# Altium project 2019主控板v1.1.PrjPcb
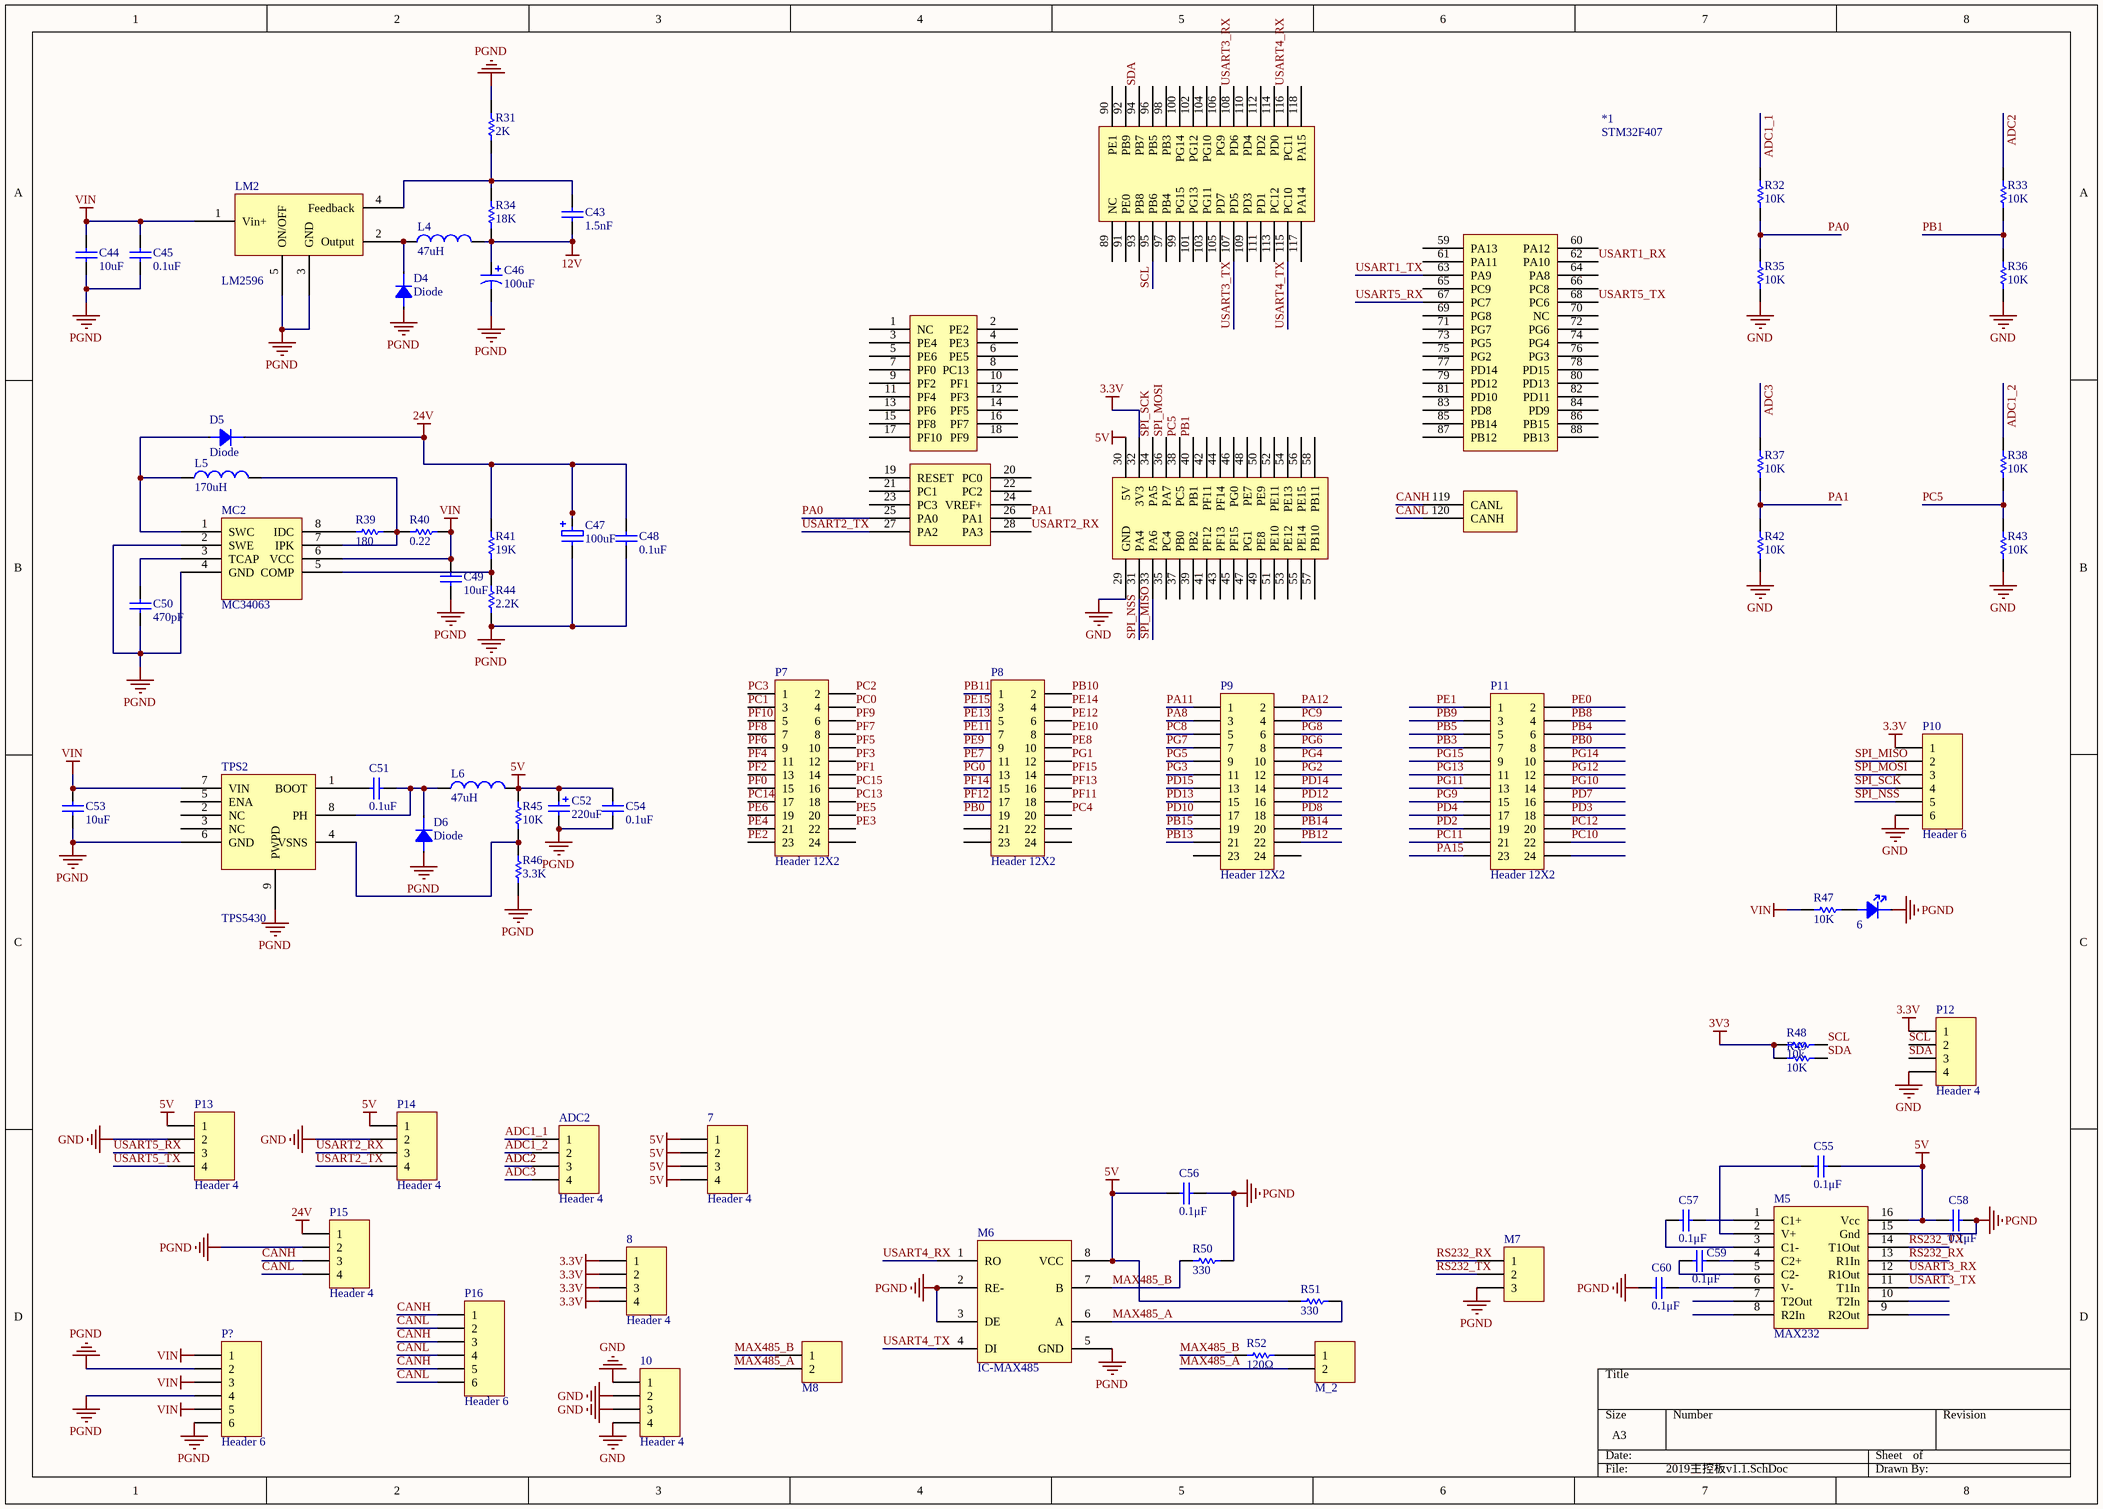
[diagram p0: 2019主控板v1.1.SchDoc]
1 sheet, 71 parts. Net scope: global (net labels, ports and power ports of the same name join across sheets).
Board file: 2019主控板v1.1.PcbDoc

## Sheet 2019主控板v1.1.SchDoc
size A3

### Parts
6  lED  [0805D]  (value not drawn)
7  Header 4  [HDR1X4]
8  Header 4  [HDR1X4]
10  Header 4  [HDR1X4]
*1  STM32F407  [STM32F407]
ADC2  Header 4  [HDR1X4]
C43  value 1.5nF  [CAP-MLCC-0603]  (hidden comment: Cap)
C44  value 10uF  [0805C]  (hidden comment: Cap)
C45  value 0.1uF  [CAP-MLCC-0603]  (hidden comment: Cap)
C46  value 100uF  [6032C]  (hidden comment: Cap Pol3)
C47  100uF  [C_ELE]
C48  value 0.1uF  [CAP-MLCC-0603]  (hidden comment: Cap)
C49  value 10uF  [0805C]  (hidden comment: Cap)
C50  value 470pF  [CAP-MLCC-0603]  (hidden comment: Cap)
C51  value 0.1uF  [CAP-MLCC-0603]  (hidden comment: Cap)
C52  value 220uF  [CAP-TAN-7343/CAPD]  (hidden comment: Cap Pol1)
C53  value 10uF  [0805C]  (hidden comment: Cap)
C54  value 0.1uF  [CAP-MLCC-0603]  (hidden comment: Cap)
C55  0.1μF  [CAP-MLCC-0603]
C56  0.1μF  [CAP-MLCC-0603]
C57  0.1μF  [CAP-MLCC-0603]
C58  0.1μF  [CAP-MLCC-0603]
C59  0.1μF  [CAP-MLCC-0603]
C60  0.1μF  [CAP-MLCC-0603]
D4  Diode  [SS34]
D5  Diode  [SS34]
D6  Diode  [SS34]
L4  value 47uH  [CD52]  (hidden comment: Inductor)
L5  value 170uH  [CD74]  (hidden comment: Inductor)
L6  value 47uH  [CD52]  (hidden comment: Inductor)
LM2  LM2596  [TO-263-5]
M5  MAX232  [SO-16_M]
M6  IC-MAX485  [SO8_M]
M7  Header 3  [Green_3P]  (value not drawn)
M8  Header 2  [Green_2P]  (value not drawn)
M_2  Header 2  [SIP2]  (value not drawn)
MC2  MC34063  [SO8]
P7  Header 12X2  [HDR2X12]
P8  Header 12X2  [HDR2X12]
P9  Header 12X2  [HDR2X12]
P10  Header 6  [HDR1X6]
P11  Header 12X2  [HDR2X12]
P12  Header 4  [HDR1X4]
P13  Header 4  [HDR1X4]
P14  Header 4  [HDR1X4]
P15  Header 4  [XH-2.54pin4]
P16  Header 6  [Green_6P]
P?  Header 6  [Green_6P]
R31  value 2K  [RES-0603]  (hidden comment: Res1)
R32  value 10K  [RES-0603]  (hidden comment: Res1)
R33  value 10K  [RES-0603]  (hidden comment: Res1)
R34  value 18K  [RES-0603]  (hidden comment: Res1)
R35  value 10K  [RES-0603]  (hidden comment: Res1)
R36  value 10K  [RES-0603]  (hidden comment: Res1)
R37  value 10K  [RES-0603]  (hidden comment: Res1)
R38  value 10K  [RES-0603]  (hidden comment: Res1)
R39  value 180  [RES-0603]  (hidden comment: Res1)
R40  value 0.22  [RES-0603]  (hidden comment: Res1)
R41  value 19K  [RES-0603]  (hidden comment: Res1)
R42  value 10K  [RES-0603]  (hidden comment: Res1)
R43  value 10K  [RES-0603]  (hidden comment: Res1)
R44  value 2.2K  [RES-0603]  (hidden comment: Res1)
R45  value 10K  [RES-0603]  (hidden comment: Res1)
R46  value 3.3K  [RES-0603]  (hidden comment: Res1)
R47  value 10K  [RES-0603]  (hidden comment: Res1)
R48  10k  [RES-0603]
R49  10K  [RES-0603]
R50  330  [RES-0603]
R51  330  [RES-0603]
R52  120Ω  [RES-0603]
TPS2  TPS5430  [TPS5430]

### Nets
3.3V: 8.1 8.2 8.3 8.4 *1.32(3V3) P10.1 P12.1
3V3: R48.1 R49.1
5V: 7.1 7.2 7.3 7.4 *1.30(5V) C52.1 C54.2 C55.2 C56.1 C58.1 L6.2 M5.16(Vcc) M6.8(VCC) P13.1 P14.1 R45.2 R51.2
12V: C43.1 C46.1 L4.2 R34.1
24V: C47.1 C48.2 D5.K P15.1 R41.1
GND: 10.1 10.2 10.3 10.4 *1.29(GND) P10.6 P12.4 P13.2 P14.2 R35.1 R36.1 R42.1 R43.1
PGND: 6.K C44.1 C45.1 C46.2 C47.2 C48.1 C49.1 C50.1 C52.2 C53.1 C54.1 C56.2 C58.2 C60.1 D4.A D6.A LM2.3(GND) LM2.5(ON/OFF) M5.15(Gnd) M6.2(RE-) M6.3(DE) M6.5(GND) M7.3 MC2.2(SWE) MC2.4(GND) P15.2 P?.2 P?.4 P?.6 R31.1 R44.2 R46.1 R50.1 TPS2.6(GND) TPS2.9(PWPD)
VIN: C44.2 C45.2 C49.2 C53.2 LM2.1(Vin+) MC2.6(VCC) P?.1 P?.3 P?.5 R40.1 R47.2 TPS2.7(VIN)
ADC1_1: ADC2.1 R32.2
ADC1_2: ADC2.2 R38.2
ADC2: ADC2.3 R33.2
ADC3: ADC2.4 R37.2
CANH: *1.119(CANL) P15.3 P16.1 P16.3 P16.5
CANL: *1.120(CANH) P15.4 P16.2 P16.4 P16.6
MAX485_A: M6.6(A) M8.2 M_2.2 R51.1
MAX485_B: M6.7(B) M8.1 R50.2 R52.2
PA0: *1.25(PA0) R32.1 R35.2
PA1: *1.26(PA1) R37.1 R42.2
PA8: P9.3
PA11: P9.1
PA12: P9.2
PA15: P11.23
PB0: P8.19 P11.8
PB1: *1.40(PB1) R33.1 R36.2
PB3: P11.7
PB4: P11.6
PB5: P11.5
PB8: P11.4
PB9: P11.3
PB10: P8.2
PB11: P8.1
PB12: P9.22
PB13: P9.21
PB14: P9.20
PB15: P9.19
PC0: P7.4
PC1: P7.3
PC2: P7.2
PC3: P7.1
PC4: P8.20
PC5: *1.38(PC5) R38.1 R43.2
PC8: P9.5
PC9: P9.4
PC10: P11.22
PC11: P11.21
PC12: P11.20
PC13: P7.18
PC14: P7.17
PC15: P7.16
PD2: P11.19
PD3: P11.18
PD4: P11.17
PD7: P11.16
PD8: P9.18
PD10: P9.17
PD12: P9.16
PD13: P9.15
PD14: P9.14
PD15: P9.13
PE0: P11.2
PE1: P11.1
PE2: P7.23
PE3: P7.22
PE4: P7.21
PE5: P7.20
PE6: P7.19
PE7: P8.11
PE8: P8.10
PE9: P8.9
PE10: P8.8
PE11: P8.7
PE12: P8.6
PE13: P8.5
PE14: P8.4
PE15: P8.3
PF0: P7.15
PF1: P7.14
PF2: P7.13
PF3: P7.12
PF4: P7.11
PF5: P7.10
PF6: P7.9
PF7: P7.8
PF8: P7.7
PF9: P7.6
PF10: P7.5
PF11: P8.18
PF12: P8.17
PF13: P8.16
PF14: P8.15
PF15: P8.14
PG0: P8.13
PG1: P8.12
PG2: P9.12
PG3: P9.11
PG4: P9.10
PG5: P9.9
PG6: P9.8
PG7: P9.7
PG8: P9.6
PG9: P11.15
PG10: P11.14
PG11: P11.13
PG12: P11.12
PG13: P11.11
PG14: P11.10
PG15: P11.9
RS232_RX: M5.13(R1In) M7.1
RS232_TX: M5.14(T1Out) M7.2
SCL: *1.95(PB6) P12.2 R48.2
SDA: *1.94(PB7) P12.3 R49.2
SPI_MISO: *1.33(PA6) P10.2
SPI_MOSI: *1.36(PA7) P10.3
SPI_NSS: *1.31(PA4) P10.5
SPI_SCK: *1.34(PA5) P10.4
USART1_RX: *1.62(PA10)
USART1_TX: *1.63(PA9)
USART2_RX: *1.28(PA3) P14.3
USART2_TX: *1.27(PA2) P14.4
USART3_RX: *1.108(PD6) M5.12(R1Out)
USART3_TX: *1.107(PD5) M5.11(T1In)
USART4_RX: *1.116(PC11) M6.1(RO)
USART4_TX: *1.115(PC10) M6.4(DI)
USART5_RX: *1.67(PC7) P13.3
USART5_TX: *1.68(PC6) P13.4
Net6_A: 6.A R47.1
NetC43_2: C43.2 LM2.4(Feedback) R31.2 R34.2
NetC50_2: C50.2 MC2.3(TCAP)
NetC51_1: C51.1 TPS2.1(BOOT)
NetC51_2: C51.2 D6.K L6.1 TPS2.8(PH)
NetC55_1: C55.1 M5.2(V+)
NetC57_1: C57.1 M5.3(C1-)
NetC57_2: C57.2 M5.1(C1+)
NetC59_1: C59.1 M5.5(C2-)
NetC59_2: C59.2 M5.4(C2+)
NetC60_2: C60.2 M5.6(V-)
NetD4_K: D4.K L4.1 LM2.2(Output)
NetD5_A: D5.A L5.1 MC2.1(SWC)
NetL5_2: L5.2 MC2.7(IPK) R39.1 R40.2
NetM_2_1: M_2.1 R52.1
NetMC2_5: MC2.5(COMP) R41.2 R44.1
NetMC2_8: MC2.8(IDC) R39.2
NetR45_1: R45.1 R46.2 TPS2.4(VSNS)

Not connected (* = marked no-connect by the designer): *1 1(NC) 2(PE2) 3(PE4) 4(PE3) 5(PE6) 6(PE5) 7(PF0) 8(PC13) 9(PF2) 10(PF1) 11(PF4) 12(PF3) 13(PF6) 14(PF5) 15(PF8) 16(PF7) 17(PF10) 18(PF9) 19(RESET) 20(PC0) 21(PC1) 22(PC2) 23(PC3) 24(VREF+) 35(PC4) 37(PB0) 39(PB2) 41(PF12) 42(PF11) 43(PF13) 44(PF14) 45(PF15) 46(PG0) 47(PG1) 48(PE7) 49(PE8) 50(PE9) 51(PE10) 52(PE11) 53(PE12) 54(PE13) 55(PE14) 56(PE15) 57(PB10) 58(PB11) 59(PA13) 60(PA12) 61(PA11) 64(PA8) 65(PC9) 66(PC8) 69(PG8) 70(NC) 71(PG7) 72(PG6) 73(PG5) 74(PG4) 75(PG2) 76(PG3) 77(PD14) 78(PD15) 79(PD12) 80(PD13) 81(PD10) 82(PD11) 83(PD8) 84(PD9) 85(PB14) 86(PB15) 87(PB12) 88(PB13) 89(NC) 90(PE1) 91(PE0) 92(PB9) 93(PB8) 96(PB5) 97(PB4) 98(PB3) 99(PG15) 100(PG14) 101(PG13) 102(PG12) 103(PG11) 104(PG10) 105(PD7) 106(PG9) 109(PD3) 110(PD4) 111(PD1) 112(PD2) 113(PC12) 114(PD0) 117(PA14) 118(PA15); M5 7(T2Out) 8(R2In) 9(R2Out) 10(T2In); P7 24; P8 21 22 23 24; P9 23 24; P11 24; TPS2 2(NC) 3(NC) 5(ENA)

### Library data of the parts
6 = 00-D-LED
7 8 10 ADC2 P12-P15 = Header 4: Header, 4-Pin; LatestRevisionDate: 17-Jul-2002; LatestRevisionNote: Re-released for DXP Platform.; Publisher: Altium Limited
C43-C45 C48-C51 C53 C54 = Cap: Capacitor; Published: 8-Jun-2000; LatestRevisionDate: 17-Jul-2002; LatestRevisionNote: Re-released for DXP Platform.; PackageReference: RAD-0.3; Publisher: Altium Limited
C46 = Cap Pol3: Polarized Capacitor (Surface Mount); Published: 8-Jun-2000; LatestRevisionDate: 17-Jul-2002; LatestRevisionNote: Re-released for DXP Platform.; PackageReference: C0805; Publisher: Altium Limited
C47 = CAP-ELE: 电解电容; Value: *μF; Published: 8-Jun-2000; LatestRevisionDate: 17-Jul-2002; LatestRevisionNote: Re-released for DXP Platform.; PackageReference: RB7.6-15; Publisher: Altium Limited; PackageDescription: Polarized Capacitor (Radial); 2 Leads
C52 = Cap Pol1: Polarized Capacitor (Radial); Published: 8-Jun-2000; LatestRevisionDate: 17-Jul-2002; LatestRevisionNote: Re-released for DXP Platform.; PackageReference: RB7.6-15; Publisher: Altium Limited
C55-C60 = CAP: 无极性电容; Value: *μF; Published: 8-Jun-2000; LatestRevisionDate: 17-Jul-2002; LatestRevisionNote: Re-released for DXP Platform.; PackageReference: RAD-0.3; Publisher: Altium Limited; PackageDescription: Radial Cap, Thru-Hole; 2 Leads; 0.3 in Pin Spacing
L4-L6 = Inductor: Code_IEC: 1005; Published: 8-Jun-2000; LatestRevisionDate: 17-Jul-2002; LatestRevisionNote: Re-released for DXP Platform.; PackageReference: 0402-A; Publisher: Altium Limited; Code_JEITA: 0402
LM2 = LM2596: 12-5
M5 = IC-MAX232
M6 = IC-MAX485: MAX485
M7 = Header 3: Header, 3-Pin; LatestRevisionDate: 17-Jul-2002; LatestRevisionNote: Re-released for DXP Platform.; Publisher: Altium Limited
M8 M_2 = Header 2: Header, 2-Pin; LatestRevisionDate: 17-Jul-2002; LatestRevisionNote: Re-released for DXP Platform.; Publisher: Altium Limited
P7-P9 P11 = Header 12X2: Header, 12-Pin, Dual row; LatestRevisionDate: 17-Jul-2002; LatestRevisionNote: Re-released for DXP Platform.; Publisher: Altium Limited
P10 P16 P? = Header 6: Header, 6-Pin; LatestRevisionDate: 17-Jul-2002; LatestRevisionNote: Re-released for DXP Platform.; Publisher: Altium Limited
R31-R47 = Res1: Resistor; Published: 8-Jun-2000; LatestRevisionDate: 17-Jul-2002; LatestRevisionNote: Re-released for DXP Platform.; PackageReference: AXIAL-0.3; Publisher: Altium Limited
R48-R52 = RES: 电阻; Value: *kΩ; Published: 8-Jun-2000; LatestRevisionDate: 17-Jul-2002; LatestRevisionNote: Re-released for DXP Platform.; PackageReference: AXIAL-0.3; Publisher: Altium Limited; PackageDescription: Axial Device, Thru-Hole; 2 Leads; 0.3 in Pin Spacing